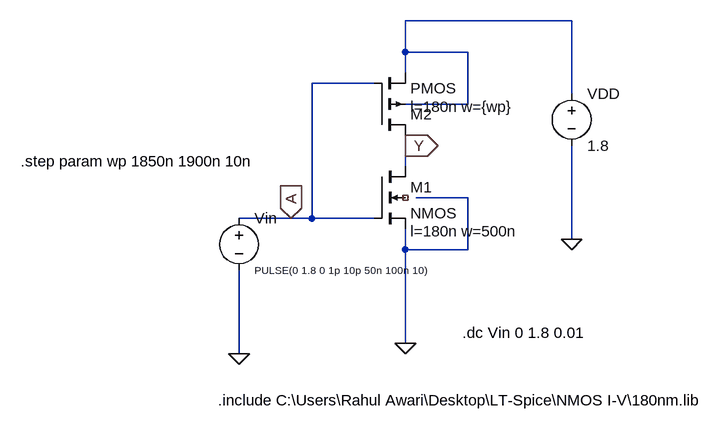
[diagram p0: schematic Cmos.asc]
Cmos.asc, the LTspice schematic file:
Version 4
SHEET 1 880 680
WIRE 432 48 176 48
WIRE 176 96 176 48
WIRE 272 96 176 96
WIRE 176 128 176 96
WIRE 128 144 32 144
WIRE 432 160 432 48
WIRE 272 176 272 96
WIRE 272 176 176 176
WIRE 176 240 176 224
WIRE 176 272 176 240
WIRE 272 320 192 320
WIRE 0 352 -80 352
WIRE 32 352 32 144
WIRE 32 352 0 352
WIRE 128 352 32 352
WIRE 432 384 432 240
WIRE 176 400 176 368
WIRE 272 400 272 320
WIRE 272 400 176 400
WIRE 176 544 176 400
WIRE -80 560 -80 432
FLAG 176 544 0
FLAG 432 384 0
FLAG -80 560 0
FLAG 0 352 A
IOPIN 0 352 In
FLAG 176 240 Y
IOPIN 176 240 Out
SYMBOL nmos4 128 272 R0
WINDOW 123 56 100 Left 2
SYMATTR Value2 l=180n w=500n
SYMATTR InstName M1
SYMBOL pmos4 128 224 M180
WINDOW 123 56 44 Left 2
SYMATTR Value2 l=180n w={wp}
SYMATTR InstName M2
SYMBOL voltage 432 144 R0
WINDOW 123 0 0 Left 0
WINDOW 39 0 0 Left 0
SYMATTR InstName VDD
SYMATTR Value 1.8
SYMBOL voltage -80 336 R0
WINDOW 3 24 96 Left 1
WINDOW 123 0 0 Left 0
WINDOW 39 0 0 Left 0
SYMATTR Value PULSE(0 1.8 0 1p 10p 50n 100n 10)
SYMATTR InstName Vin
TEXT -112 632 Left 2 !.include C:\\Users\\Rahul Awari\\Desktop\\LT-Spice\\NMOS I-V\\180nm.lib
TEXT 264 528 Left 2 !.dc Vin 0 1.8 0.01
TEXT -416 264 Left 2 !.step param wp 1850n 1900n 10n

The netlist it stands for:
* Cmos.asc
M1 Y A 0 NC_01 NMOS l=180n w=500n
M2 Y A N001 N001 PMOS l=180n w={wp}
VDD N001 0 1.8
Vin A 0 PULSE(0 1.8 0 1p 10p 50n 100n 10)
.model NMOS NMOS
.model PMOS PMOS
.lib standard.mos
.include C:\Users\Rahul Awari\Desktop\LT-Spice\NMOS I-V\180nm.lib
.dc Vin 0 1.8 0.01
.step param wp 1850n 1900n 10n
.backanno
.end

* Results of the author's LTspice run, read from the files saved beside the schematic
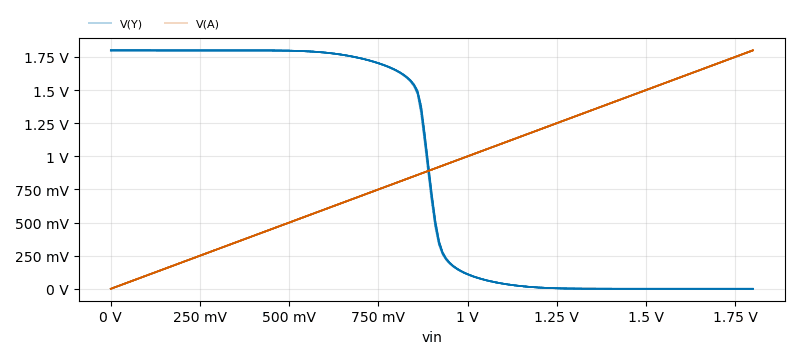
[diagram p1: DC transfer characteristic of Cmos.asc, plotted from the saved traces]
* DC transfer characteristic, 6 runs:
*   V(Y) [wp=1.85e-006]: 1.8 V at vin=0 V, 5.922 nV at vin=1.8 V, min 5.922 nV, max 1.8 V
*   V(Y) [wp=1.86e-006]: 1.8 V at vin=0 V, 5.939 nV at vin=1.8 V, min 5.939 nV, max 1.8 V
*   V(Y) [wp=1.87e-006]: 1.8 V at vin=0 V, 5.957 nV at vin=1.8 V, min 5.957 nV, max 1.8 V
*   V(Y) [wp=1.88e-006]: 1.8 V at vin=0 V, 5.974 nV at vin=1.8 V, min 5.974 nV, max 1.8 V
*   V(Y) [wp=1.89e-006]: 1.8 V at vin=0 V, 5.992 nV at vin=1.8 V, min 5.992 nV, max 1.8 V
*   V(Y) [wp=1.9e-006]: 1.8 V at vin=0 V, 6.009 nV at vin=1.8 V, min 6.009 nV, max 1.8 V
*   V(A) [wp=1.85e-006]: 0 V at vin=0 V, 1.8 V at vin=1.8 V, min 0 V, max 1.8 V
*   V(A) [wp=1.86e-006]: 0 V at vin=0 V, 1.8 V at vin=1.8 V, min 0 V, max 1.8 V
*   V(A) [wp=1.87e-006]: 0 V at vin=0 V, 1.8 V at vin=1.8 V, min 0 V, max 1.8 V
*   V(A) [wp=1.88e-006]: 0 V at vin=0 V, 1.8 V at vin=1.8 V, min 0 V, max 1.8 V
*   V(A) [wp=1.89e-006]: 0 V at vin=0 V, 1.8 V at vin=1.8 V, min 0 V, max 1.8 V
*   V(A) [wp=1.9e-006]: 0 V at vin=0 V, 1.8 V at vin=1.8 V, min 0 V, max 1.8 V